# EAGLE design FlashyStick (EAGLE 7.7.0)
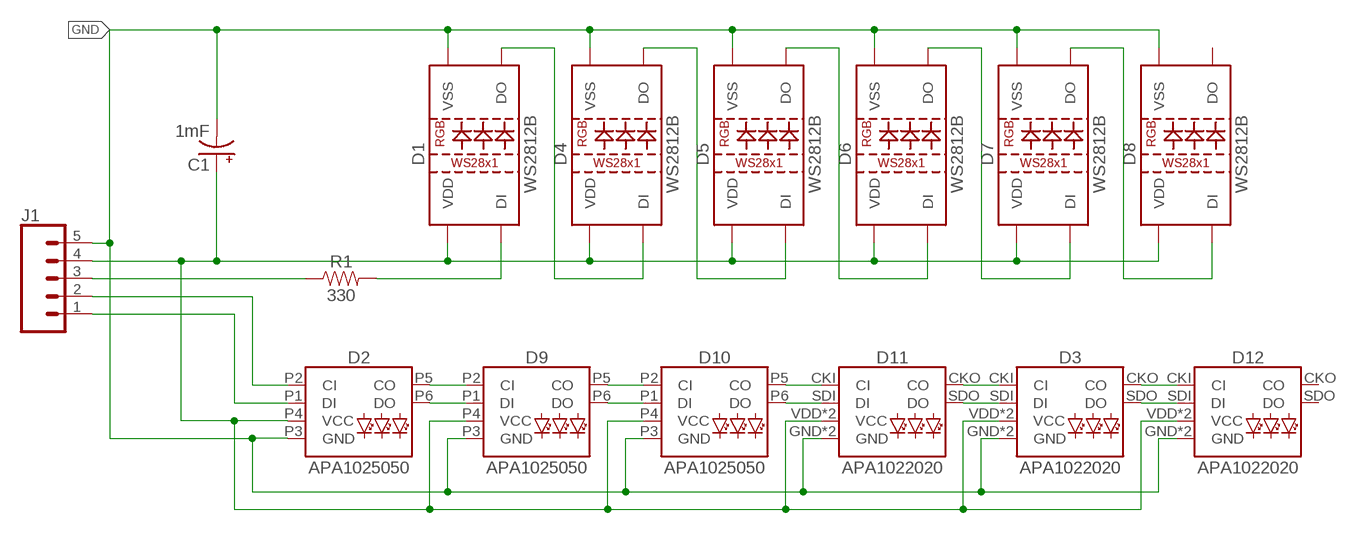
[diagram p0: schematic, sheet 1]

## Parts
C1  1mF  1000UF-RADIAL-5MM-25V-20%  [CPOL-RADIAL-5MM-10MM]
D1  WS2812B  [WS2812B]
D2  APA1025050  [APA102-5050]
D3  APA1022020  [APA102-2020]
D4  WS2812B  [WS2812B]
D5  WS2812B  [WS2812B]
D6  WS2812B  [WS2812B]
D7  WS2812B  [WS2812B]
D8  WS2812B  [WS2812B]
D9  APA1025050  [APA102-5050]
D10  APA1025050  [APA102-5050]
D11  APA1022020  [APA102-2020]
D12  APA1022020  [APA102-2020]
J1  CONN_05  [1X05]
R1  330  330OHM-0603-1/10W-1%  [0603]

## Nets
GND: C1.- D1.3(VSS) D2.P3(GND) D3.GND D3.GNDPAD(GND) D4.3(VSS) D5.3(VSS) D6.3(VSS) D7.3(VSS) D8.3(VSS) D9.P3(GND) D10.P3(GND) D11.GND D11.GNDPAD(GND) D12.GND D12.GNDPAD(GND) J1.5
N$3: J1.3 R1.1
N$4: D1.4(DI) R1.2
N$5: D1.2(DO) D4.4(DI)
N$6: D4.2(DO) D5.4(DI)
N$7: D5.2(DO) D6.4(DI)
N$8: D6.2(DO) D7.4(DI)
N$9: D7.2(DO) D8.4(DI)
N$10: D2.P2(CI) J1.2
N$11: D2.P1(DI) J1.1
N$12: D2.P5(CO) D9.P2(CI)
N$13: D2.P6(DO) D9.P1(DI)
N$14: D9.P5(CO) D10.P2(CI)
N$15: D9.P6(DO) D10.P1(DI)
N$16: D10.P5(CO) D11.CKI(CI)
N$17: D10.P6(DO) D11.SDI(DI)
N$18: D3.CKI(CI) D11.CKO(CO)
N$19: D3.SDI(DI) D11.SDO(DO)
N$20: D3.CKO(CO) D12.CKI(CI)
N$21: D3.SDO(DO) D12.SDI(DI)
N$22: C1.+ D1.1(VDD) D2.P4(VCC) D3.VDD(VCC) D3.VDDPAD(VCC) D4.1(VDD) D5.1(VDD) D6.1(VDD) D7.1(VDD) D8.1(VDD) D9.P4(VCC) D10.P4(VCC) D11.VDD(VCC) D11.VDDPAD(VCC) D12.VDD(VCC) D12.VDDPAD(VCC) J1.4
Unconnected: D8.2(DO) D12.CKO(CO) D12.SDO(DO)

## Library data of the parts
C1 = SparkFun-Capacitors:1000UF: 1,000µF/1mF ceramic capacitors A capacitor is a passive two-terminal electrical component used to store electrical energy temporarily in an electric field. CAP-08070; PROD_ID: CAP-09538
D1 D4-D8 = SparkFun-LED:WS2812B: WS2812B SMD addressable RGB LED 5x5mm SMD LED with built-in controller IC. Color: Red/Green/Blue mC Rating: RGB: 390, 660, 180 mcd Forward Voltage: RGB: 2.0, 3.0, 3.0 V Packages:WS2812B SparkFun Products: Blynk Board - ESP8266 <https://www.sparkfun.com/products/13794>; PROD_ID: DIO-12503
D2 D9 D10 = SparkFun-LED:APA102: APA102 Addressable RGB LED Used in manufacturing of various products at SparkFun Packages: 5050 2020 SparkFun Products: SparkFun Lumenati Boards <https://www.sparkfun.com/categories/405>; PROD_ID: DIO-13739
D3 D11 D12 = SparkFun-LED:APA102: APA102 Addressable RGB LED Used in manufacturing of various products at SparkFun Packages: 5050 2020 SparkFun Products: SparkFun Lumenati Boards <https://www.sparkfun.com/categories/405>; PROD_ID: DIO-13883
J1 = SparkFun-Connectors:CONN_05: Multi connection point. Often used as Generic Header-pin footprint for 0.1 inch spaced/style header connections On any of the 0.1 inch spaced packages, you can populate with these: Break Away Headers - Straight <https://www.sparkfun.com/products/116> (PRT-00116) Break Away Male Headers - Right Angle <https://www.sparkfun.com/products/553> (PRT-00553) Female Headers <https://www.sparkfun.com/products/115> (PRT-00115) Break Away Headers - Machine Pin <https://www.sparkfun.com/products/117> (PRT-00117) Break Away Female Headers - Swiss Machine Pin <https://www.sparkfun.com/products/743> (PRT-00743) For SCREWTERMINALS and SPRING TERMINALS visit here: Screw Terimnals on SparkFun.com <https://www.sparkfun.com/search/results?term=Screw+Terminals> (5mm/3.5mm/2.54mm spacing) This device is also useful as a general connection point to wire up your design to another part of your project. Our various solder wires solder well into these plated through hole pads. Hook-Up Wire - Assortment (Stranded, 22 AWG) <https://www.sparkfun.com/products/11375> (PRT-11375) Hook-Up Wire - Assortment (Solid Core, 22 AWG) <https://www.sparkfun.com/products/11367> (PRT-11367) View the entire wire category on our website here <https://www.sparkfun.com/categories/141> Special notes: Molex polarized connector foot print use with SKU : PRT-08231 with associated crimp pins and housings. 1MM SMD Version SKU: PRT-10208
R1 = SparkFun-Resistors:330OHM: 330Ω resistor A resistor is a passive two-terminal electrical component that implements electrical resistance as a circuit element. Resistors act to reduce current flow, and, at the same time, act to lower voltage levels within circuits. - Wikipedia; PROD_ID: RES-00818

## Board
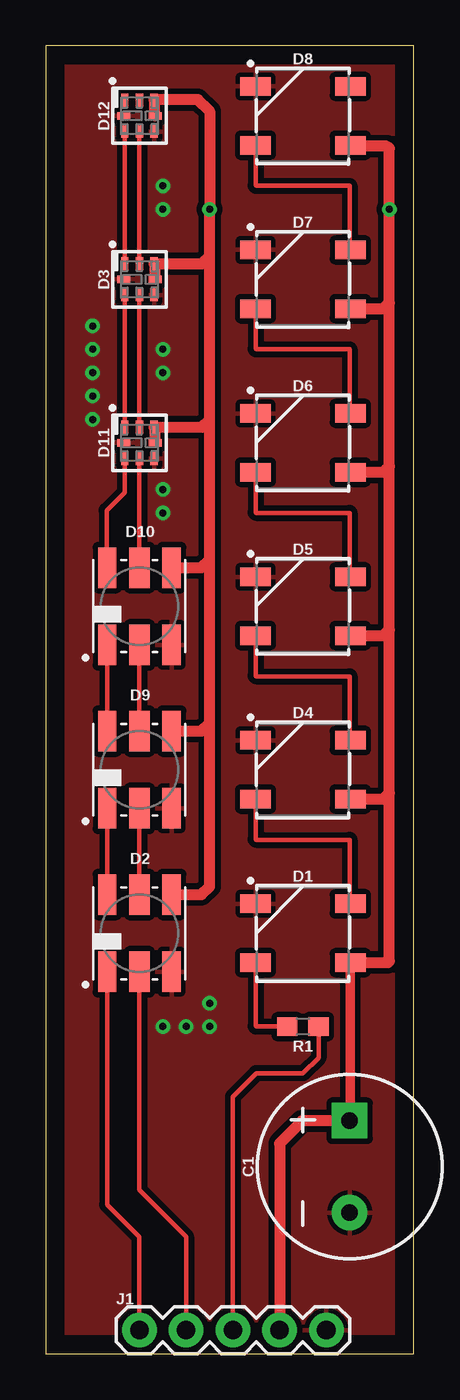
[diagram p1: board, top side]
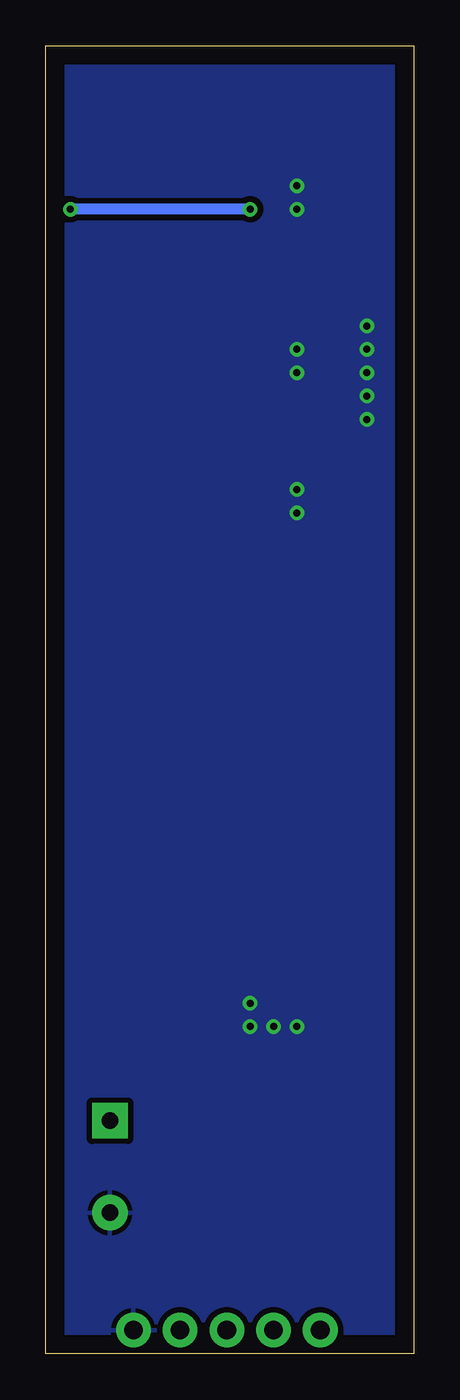
[diagram p2: board, bottom side, seen from below]

Size 19.99 x 71.11 mm. Coordinates in mm from the lower left corner, seen from the top.
Outline: 0,0 19.99,0 19.99,71.11 0,71.11 0,0
Copper layers (1*16): Top 0.035mm / dielectric 1.5mm / Bottom 0.035mm
Design rules "default": minimum track width 10mil, minimum drill 0.6mm, track to track 8mil, track to pad 8mil, pad to pad 8mil, via to via 8mil, smd to smd 8mil, copper to edge 40mil, drill to drill 8mil, minimum pad ring 10mil, minimum via ring 8mil, stop-mask expansion 4mil, vias tented up to drill 0mil, thermal gap 10mil

### Footprints (pad centres in the part's own frame; a part is rotated, then mirrored left to right if it is on the bottom)
CPOL-RADIAL-5MM-10MM = drill 0.9 pad 1.93 square: + 2.5,0 | drill 0.9 pad 1.93: - -2.5,0
WS2812B = smd 1.651 x 1: 1 2.577,-1.6; 2 2.577,1.6; 3 -2.577,1.6; 4 -2.577,-1.6
APA102-5050 = smd 1 x 2.2: P1 -1.75,-2.1; P3 1.75,-2.1; P4 1.75,2.1; P6 -1.75,2.1 | smd 1.1 x 2.2: P2 0,-2.1; P5 0,2.1
APA102-2020 = smd 0.7 x 0.4: CKI -0.85,0; CKO 0.85,0; GND -0.85,-0.8; SDI -0.85,0.8; SDO 0.85,0.8; VDD 0.85,-0.8 | smd 0.4 x 0.7: GNDPAD 0,0.85; VDDPAD 0,-0.85
1X05 = drill 1.016 pad 1.88: 1 0,0; 2 2.54,0; 3 5.08,0; 4 7.62,0; 5 10.16,0
0603 = smd 1.1 x 1: 1 -0.85,0; 2 0.85,0

### Placement (x,y rotation side)
C1  16.51,10.16 90 top
D1  13.97,22.86 0 top
D2  5.08,22.86 0 top
D3  5.08,58.42 90 top
D4  13.97,31.75 0 top
D5  13.97,40.64 0 top
D6  13.97,49.53 0 top
D7  13.97,58.42 0 top
D8  13.97,67.31 0 top
D9  5.08,31.75 0 top
D10  5.08,40.64 0 top
D11  5.08,49.53 90 top
D12  5.08,67.31 90 top
J1  5.08,1.27 0 top
R1  13.97,17.78 180 top

### Tracks (layer width: path | path; a pad name or v marks a point on that pad's centre or on a via)
GND  (via drill 0.38)
  other vias: 6.35,17.78 7.62,17.78 8.89,17.78 8.89,19.05 2.54,55.88 2.54,54.61 2.54,53.34 2.54,52.07 2.54,50.8 6.35,63.5 6.35,62.23 6.35,54.61 6.35,53.34 6.35,46.99 6.35,45.72
  pour Top (isolate 0.305): 0,71.12 20.32,71.12 20.32,0 0,0
  pour Bottom (isolate 0.305): 0,71.12 20.32,71.12 20.32,0 0,0
N$3
  Top 0.254: R1.1 14.82,16.09 13.97,15.24 11.43,15.24 10.16,13.97 J1.3
N$4
  Top 0.254: D1.4 11.39,17.82 11.43,17.78 R1.2
N$5
  Top 0.254: D4.4 11.39,27.98 11.43,27.94 16.51,27.94 16.51,24.5 D1.2
N$6
  Top 0.254: D5.4 11.39,36.87 11.43,36.83 16.51,36.83 16.51,33.39 D4.2
N$7
  Top 0.254: D6.4 11.39,45.76 11.43,45.72 16.51,45.72 16.51,42.28 D5.2
N$8
  Top 0.254: D7.4 11.39,54.65 11.43,54.61 16.51,54.61 16.51,51.17 D6.2
N$9
  Top 0.254: D8.4 11.39,63.54 11.43,63.5 16.51,63.5 16.51,60.06 D7.2
N$10
  Top 0.254: D2.P2 5.08,8.89 7.62,6.35 J1.2
N$11
  Top 0.254: D2.P1 3.33,8.1 5.08,6.35 J1.1
N$12
  Top 0.254: D9.P2 D2.P5
N$13
  Top 0.254: D9.P1 D2.P6
N$14
  Top 0.254: D10.P2 D9.P5
N$15
  Top 0.254: D10.P1 D9.P6
N$16
  Top 0.254: D11.CKI D10.P5
N$17
  Top 0.254: D11.SDI 4.28,46.83 3.3,45.85 3.3,42.77 D10.P6
N$18
  Top 0.254: D3.CKI D11.CKO
N$19
  Top 0.254: D3.SDI D11.SDO
N$20
  Top 0.254: D12.CKI D3.CKO
N$21
  Top 0.254: D12.SDI D3.SDO
N$22  (via drill 0.38)
  Top 0.254: 16.55,12.7 C1.+
  Top 0.508: D1.1 16.55,12.7
  Top 0.61: C1.+ 13.93,12.66 12.7,11.43 J1.4 | D1.1 18.59,21.26 18.67,21.34 18.67,30.48 | 18.67,30.48 18.67,39.37 | 18.67,39.37 18.67,48.26 | 18.67,48.26 18.67,57.15 | 18.67,57.15 v18.67,62.23 18.67,65.53 18.54,65.66 16.6,65.66 D8.1 | D4.1 18.34,30.15 18.67,30.48 | D5.1 18.34,39.04 18.67,39.37 | D7.1 18.34,56.82 18.67,57.15 | D6.1 18.34,47.93 18.67,48.26 | D2.P4 8.45,24.96 8.89,25.4 8.89,34.29 | 8.89,34.29 8.89,43.18 | 8.89,43.18 8.89,50.8 | 8.89,50.8 8.89,59.69 | 8.89,59.69 v8.89,62.23 8.89,67.56 8.26,68.2 5.92,68.2 D12.VDD 5.88,67.36 D12.VDDPAD | 8.89,59.69 8.47,59.27 D3.VDD 5.93,59.22 D3.VDDPAD | 8.89,50.8 8.47,50.38 D11.VDD 5.93,50.33 D11.VDDPAD | D10.P4 8.45,42.74 8.89,43.18 | D9.P4 8.45,33.85 8.89,34.29
  Bottom 0.61: v8.89,62.23 v18.67,62.23